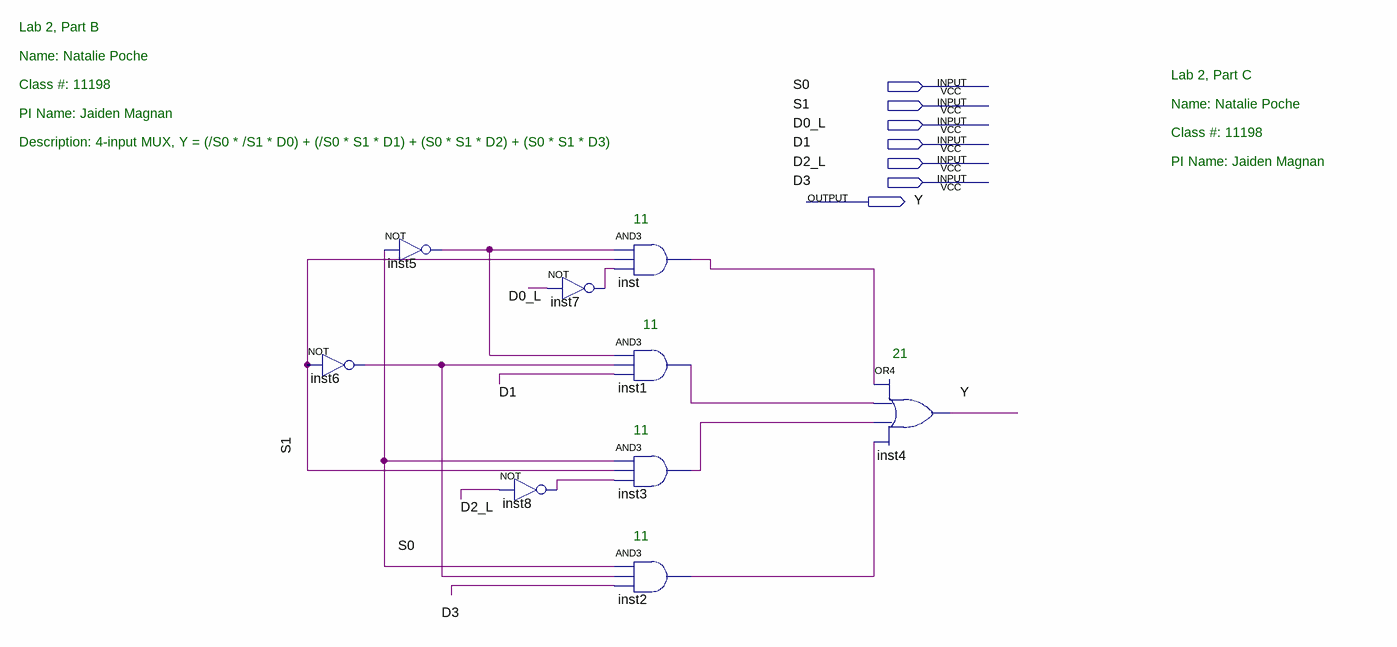
[diagram p0: schematic sheet]
// Quartus schematic lab2_combined.bdf as structural Verilog: 9 symbols, 7 pins
module lab2_combined (
  input  S0,
  input  S1,
  input  D0_L,
  input  D1,
  input  D2_L,
  input  D3,
  output Y
);

  wire inst1_out, inst2_out, inst3_out, inst5_out, inst6_out, inst7_out, inst8_out, inst_out;

  not inst6 (inst6_out, S1);
  not inst5 (inst5_out, S0);
  not inst8 (inst8_out, D2_L);
  not inst7 (inst7_out, D0_L);
  and inst (inst_out, inst5_out, S1, inst7_out);
  and inst1 (inst1_out, inst5_out, inst6_out, D1);
  and inst3 (inst3_out, S0, S1, inst8_out);
  and inst2 (inst2_out, S0, inst6_out, D3);
  or inst4 (Y, inst_out, inst1_out, inst3_out, inst2_out);

  // Notes on the sheet:
  //   Lab 2, Part B
  //   Name: Natalie Poche
  //   Lab 2, Part C
  //   Class #: 11198
  //   Name: Natalie Poche
  //   PI Name: Jaiden Magnan
  //   Class #: 11198
  //   Description: 4-input MUX, Y = (/S0 * /S1 * D0) + (/S0 * S1 * D1) + (S0 * S1 * D2) + (S0 * S1 * D3)
  //   PI Name: Jaiden Magnan
  //   11
  //   11
  //   21
  //   11
  //   11
endmodule
